# Altium schematic sheet NMT_PS2_INT.SCHDOC
size A4; Organization: Altium Limited; Address1: L3, 12a Rodborough Rd; Address2: Frenchs Forest; Address3: NSW; Address4: Australia 2086; DocumentNumber: 10; SheetNumber: 4; SheetTotal: 13
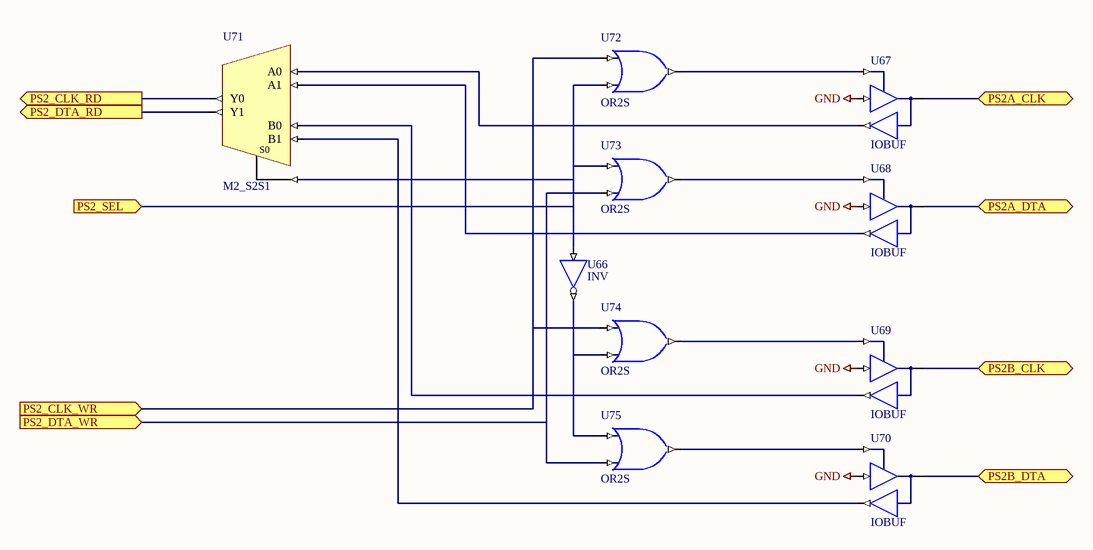
[diagram p0: NMT_PS2_INT.SCHDOC]

## Parts
U66  INV
U67  IOBUF
U68  IOBUF
U69  IOBUF
U70  IOBUF
U71  M2_S2S1
U72  OR2S
U73  OR2S
U74  OR2S
U75  OR2S

## Ports
PS2_CLK_RD (out), PS2_CLK_WR (in), PS2_DTA_RD (out), PS2_DTA_WR (in), PS2_SEL (in), PS2A_CLK (bidir), PS2A_DTA (bidir), PS2B_CLK (bidir), PS2B_DTA (bidir)

## Nets
GND: U67.I U68.I U69.I U70.I
PS2_CLK_RD: U71.Y0 ; port PS2_CLK_RD
PS2_CLK_WR: U72.I0 U74.I0 ; port PS2_CLK_WR
PS2_DTA_RD: U71.Y1 ; port PS2_DTA_RD
PS2_DTA_WR: U73.I1 U75.I1 ; port PS2_DTA_WR
PS2_SEL: U66.I U71.S0 U72.I1 U73.I0 ; port PS2_SEL
PS2A_CLK: U67.IO ; port PS2A_CLK
PS2A_DTA: U68.IO ; port PS2A_DTA
PS2B_CLK: U69.IO ; port PS2B_CLK
PS2B_DTA: U70.IO ; port PS2B_DTA
NetU66_O: U66.O U74.I1 U75.I0
NetU67_O: U67.O U71.A0
NetU67_T: U67.T U72.O
NetU68_O: U68.O U71.A1
NetU68_T: U68.T U73.O
NetU69_O: U69.O U71.B0
NetU69_T: U69.T U74.O
NetU70_O: U70.O U71.B1
NetU70_T: U70.T U75.O

## Notes on the sheet
- Title
- Size:
- Date:
- A4
- Number:
- Time:
- Revision:
- Sheet
- of
- File:

## Library data of the parts
U66 = INV: Inverter; ArchiveName: GENERIC; Published: 7-Nov-2003; Publisher: Altium Limited; Xilinx Equivalent: INV; Core Revision: 1.00.00
U67-U70 = IOBUF: Input/Output Buffer; ArchiveName: GENERIC; Published: 7-Nov-2003; Publisher: Altium Limited; Xilinx Equivalent: IOBUF; Core Revision: 1.00.00
U71 = M2_S2S1: 2x2-Single Wire to 1x2-Single Wire Multiplexer; ArchiveName: GENERIC; Published: 7-Nov-2003; Publisher: Altium Limited; Core Revision: 1.00.00
U72-U75 = OR2S: 2-Input OR Gate, Single Pin Version; Xilinx Equivalent: OR2; ArchiveName: GENERIC; Published: 7-Nov-2003; Publisher: Altium Limited; Core Revision: 1.00.00